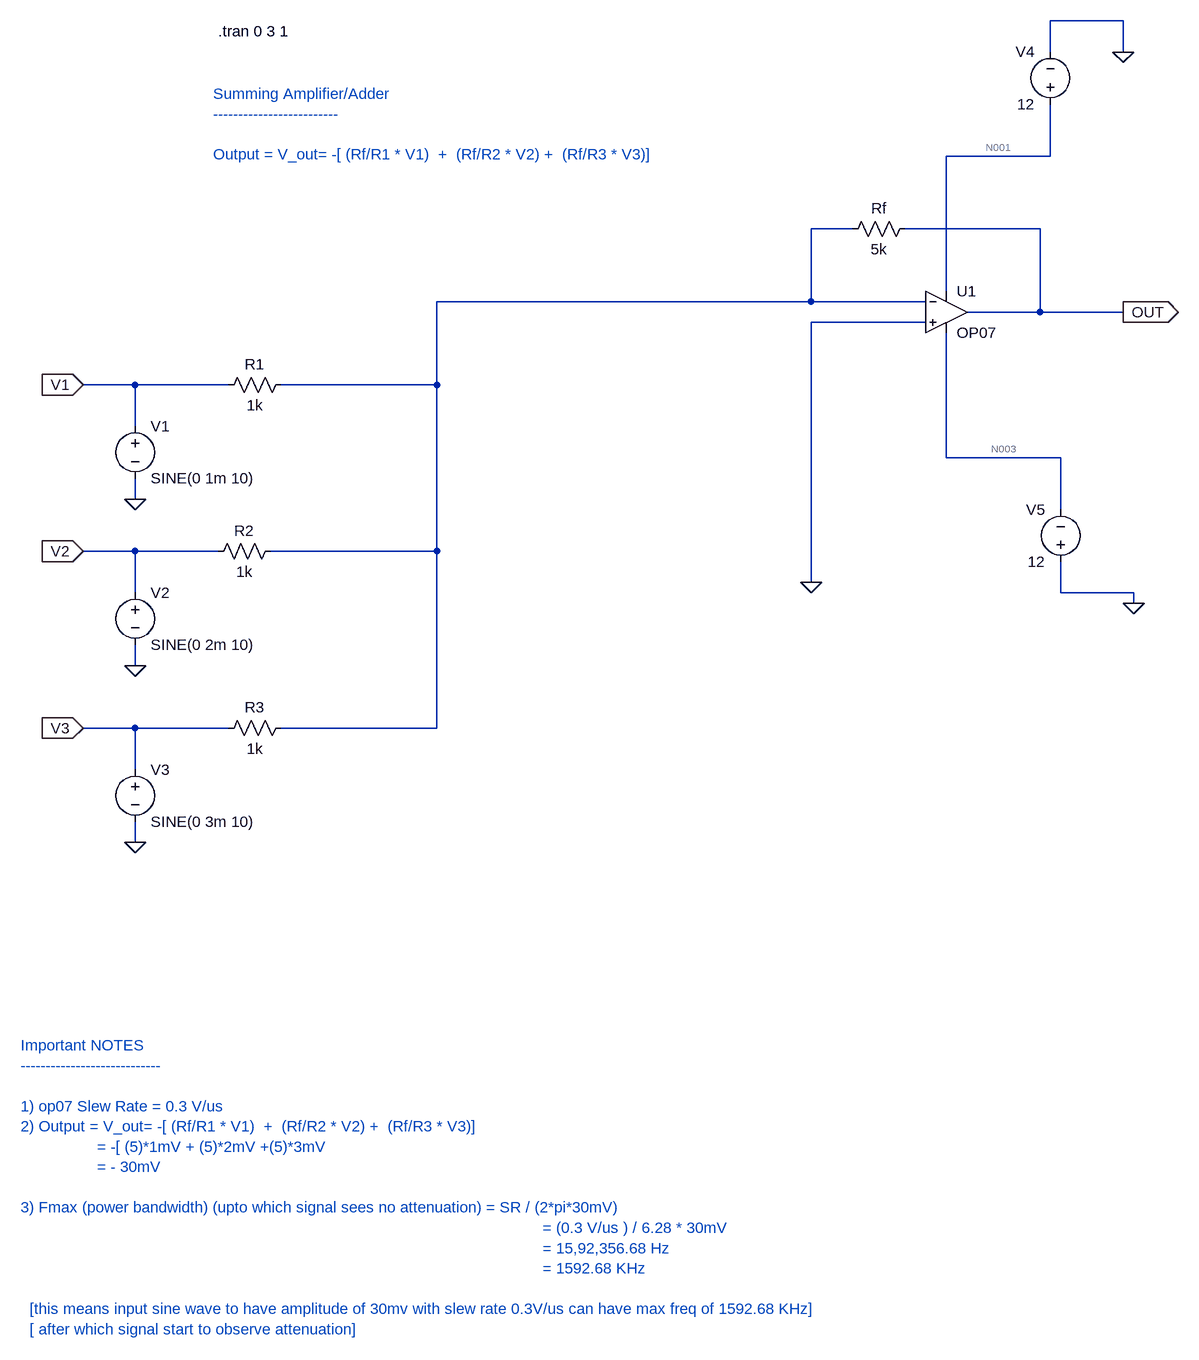
[diagram p0: schematic opAmp_as_ADDER_or_SUMMING_AMPLIFIER_with_AC_input .asc]
opAmp_as_ADDER_or_SUMMING_AMPLIFIER_with_AC_input .asc, the LTspice schematic file:
Version 4.1
SHEET 1 2948 1728
WIRE 352 -368 240 -368
WIRE 240 -320 240 -368
WIRE 352 -320 352 -368
WIRE 240 -160 240 -240
WIRE 240 -160 80 -160
WIRE -64 -48 -128 -48
WIRE 224 -48 16 -48
WIRE 80 48 80 -160
WIRE -128 64 -128 -48
WIRE -128 64 -704 64
WIRE 48 64 -128 64
WIRE 224 80 224 -48
WIRE 224 80 112 80
WIRE 352 80 224 80
WIRE 48 96 -128 96
WIRE -1168 192 -1248 192
WIRE -1024 192 -1168 192
WIRE -704 192 -704 64
WIRE -704 192 -944 192
WIRE -1168 256 -1168 192
WIRE 80 304 80 112
WIRE 256 304 80 304
WIRE -1168 368 -1168 336
WIRE 256 384 256 304
WIRE -1168 448 -1248 448
WIRE -1040 448 -1168 448
WIRE -704 448 -704 192
WIRE -704 448 -960 448
WIRE -128 496 -128 96
WIRE -1168 512 -1168 448
WIRE 256 512 256 464
WIRE 368 512 256 512
WIRE 368 528 368 512
WIRE -1168 624 -1168 592
WIRE -1168 720 -1248 720
WIRE -1024 720 -1168 720
WIRE -704 720 -704 448
WIRE -704 720 -944 720
WIRE -1168 784 -1168 720
WIRE -1168 896 -1168 864
FLAG 352 -320 0
FLAG 352 80 OUT
IOPIN 352 80 Out
FLAG -1168 368 0
FLAG -1248 192 V1
IOPIN -1248 192 In
FLAG 368 528 0
FLAG -128 496 0
FLAG -1168 624 0
FLAG -1248 448 V2
IOPIN -1248 448 In
FLAG -1168 896 0
FLAG -1248 720 V3
IOPIN -1248 720 In
SYMBOL voltage 240 -224 R180
WINDOW 0 24 96 Left 2
WINDOW 3 24 16 Left 2
WINDOW 123 0 0 Left 0
WINDOW 39 0 0 Left 0
SYMATTR InstName V4
SYMATTR Value 12
SYMBOL voltage 256 480 R180
WINDOW 0 24 96 Left 2
WINDOW 3 24 16 Left 2
WINDOW 123 0 0 Left 0
WINDOW 39 0 0 Left 0
SYMATTR InstName V5
SYMATTR Value 12
SYMBOL OpAmps\\OP07 80 16 R0
SYMATTR InstName U1
SYMBOL res 32 -64 R90
WINDOW 0 0 56 VBottom 2
WINDOW 3 32 56 VTop 2
SYMATTR InstName Rf
SYMATTR Value 5k
SYMBOL voltage -1168 240 R0
WINDOW 123 0 0 Left 0
WINDOW 39 0 0 Left 0
SYMATTR InstName V1
SYMATTR Value SINE(0 1m 10)
SYMBOL voltage -1168 496 R0
WINDOW 123 0 0 Left 0
WINDOW 39 0 0 Left 0
SYMATTR InstName V2
SYMATTR Value SINE(0 2m 10)
SYMBOL voltage -1168 768 R0
WINDOW 123 0 0 Left 0
WINDOW 39 0 0 Left 0
SYMATTR InstName V3
SYMATTR Value SINE(0 3m 10)
SYMBOL res -928 176 R90
WINDOW 0 0 56 VBottom 2
WINDOW 3 32 56 VTop 2
SYMATTR InstName R1
SYMATTR Value 1k
SYMBOL res -944 432 R90
WINDOW 0 0 56 VBottom 2
WINDOW 3 32 56 VTop 2
SYMATTR InstName R2
SYMATTR Value 1k
SYMBOL res -928 704 R90
WINDOW 0 0 56 VBottom 2
WINDOW 3 32 56 VTop 2
SYMATTR InstName R3
SYMATTR Value 1k
TEXT -1040 -352 Left 2 !.tran 0 3 1
TEXT -1048 -256 Left 2 ;Summing Amplifier/Adder\n-------------------------\n \nOutput = V_out= -[ (Rf/R1 * V1)  +  (Rf/R2 * V2) +  (Rf/R3 * V3)]
TEXT -1344 1208 Left 2 ;Important NOTES\n----------------------------\n \n1) op07 Slew Rate = 0.3 V/us\n2) Output = V_out= -[ (Rf/R1 * V1)  +  (Rf/R2 * V2) +  (Rf/R3 * V3)] \n                 = -[ (5)*1mV + (5)*2mV +(5)*3mV \n                 = - 30mV\n \n3) Fmax (power bandwidth) (upto which signal sees no attenuation) = SR / (2*pi*30mV)  \n                                                                                                                    = (0.3 V/us ) / 6.28 * 30mV \n                                                                                                                    = 15,92,356.68 Hz \n                                                                                                                    = 1592.68 KHz\n \n  [this means input sine wave to have amplitude of 30mv with slew rate 0.3V/us can have max freq of 1592.68 KHz]\n  [ after which signal start to observe attenuation]

The netlist it stands for:
* opAmp_as_ADDER_or_SUMMING_AMPLIFIER_with_AC_input .asc
V4 N001 0 12
V5 0 N003 12
X§U1 0 N002 N001 N003 OUT LT1001  ; OP07, pins In+ In- V+ V- OUT
Rf OUT N002 5k
V1 V1 0 SINE(0 1m 10)
V2 V2 0 SINE(0 2m 10)
V3 V3 0 SINE(0 3m 10)
R1 N002 V1 1k
R2 N002 V2 1k
R3 N002 V3 1k
.tran 0 3 1
* Summing Amplifier/Adder
* -------------------------
* Output = V_out= -[ (Rf/R1 * V1)  +  (Rf/R2 * V2) +  (Rf/R3 * V3)]
* Important NOTES
* ----------------------------
* 1) op07 Slew Rate = 0.3 V/us
* 2) Output = V_out= -[ (Rf/R1 * V1)  +  (Rf/R2 * V2) +  (Rf/R3 * V3)]
*                  = -[ (5)*1mV + (5)*2mV +(5)*3mV
*                  = - 30mV
* 3) Fmax (power bandwidth) (upto which signal sees no attenuation) = SR / (2*pi*30mV)
*                                                                                                                     = (0.3 V/us ) / 6.28 * 30mV
*                                                                                                                     = 15,92,356.68 Hz
*                                                                                                                     = 1592.68 KHz
*   [this means input sine wave to have amplitude of 30mv with slew rate 0.3V/us can have max freq of 1592.68 KHz]
*   [ after which signal start to observe attenuation]
.lib LTC.lib
.backanno
.end

* Results of the author's LTspice run, read from the files saved beside the schematic
* Operating Point, zero values left out:
*   V(n003) = -12 V
*   V(n001) = 12 V
*   I(V4) = -2.25 mA
*   I(V5) = -2.25 mA
*   Ix(u1:3) = 2.25 mA
*   Ix(u1:4) = -2.25 mA
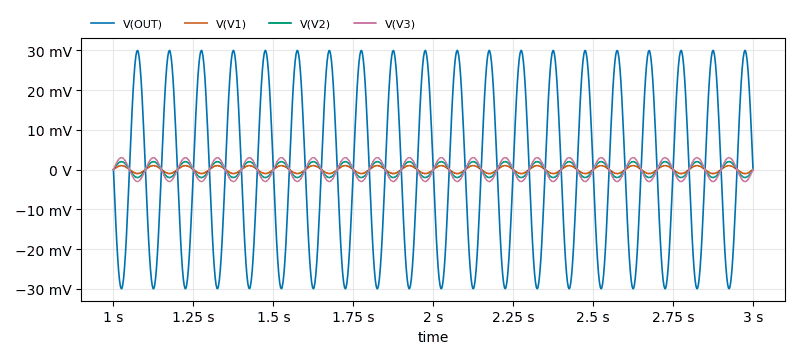
[diagram p1: Transient Analysis of opAmp_as_ADDER_or_SUMMING_AMPLIFIER_with_AC_input .asc, plotted from the saved traces]
* Transient Analysis, 1 run:
*   V(OUT): min -30 mV, max 30 mV, average -107.9 nV, rms 21.22 mV, last 5.652 µV
*   V(V1): min -1 mV, max 1 mV, average 3.604 nV, rms 707.3 µV, last 0 V
*   V(V2): min -2 mV, max 2 mV, average 7.209 nV, rms 1.415 mV, last 0 V
*   V(V3): min -3 mV, max 3 mV, average 10.81 nV, rms 2.122 mV, last 0 V